# EAGLE design Smart Tools Main Board (EAGLE 9.5.2)

## Sheet 1 of 3: Power Regulation, Battery Charging, Voltage Boost
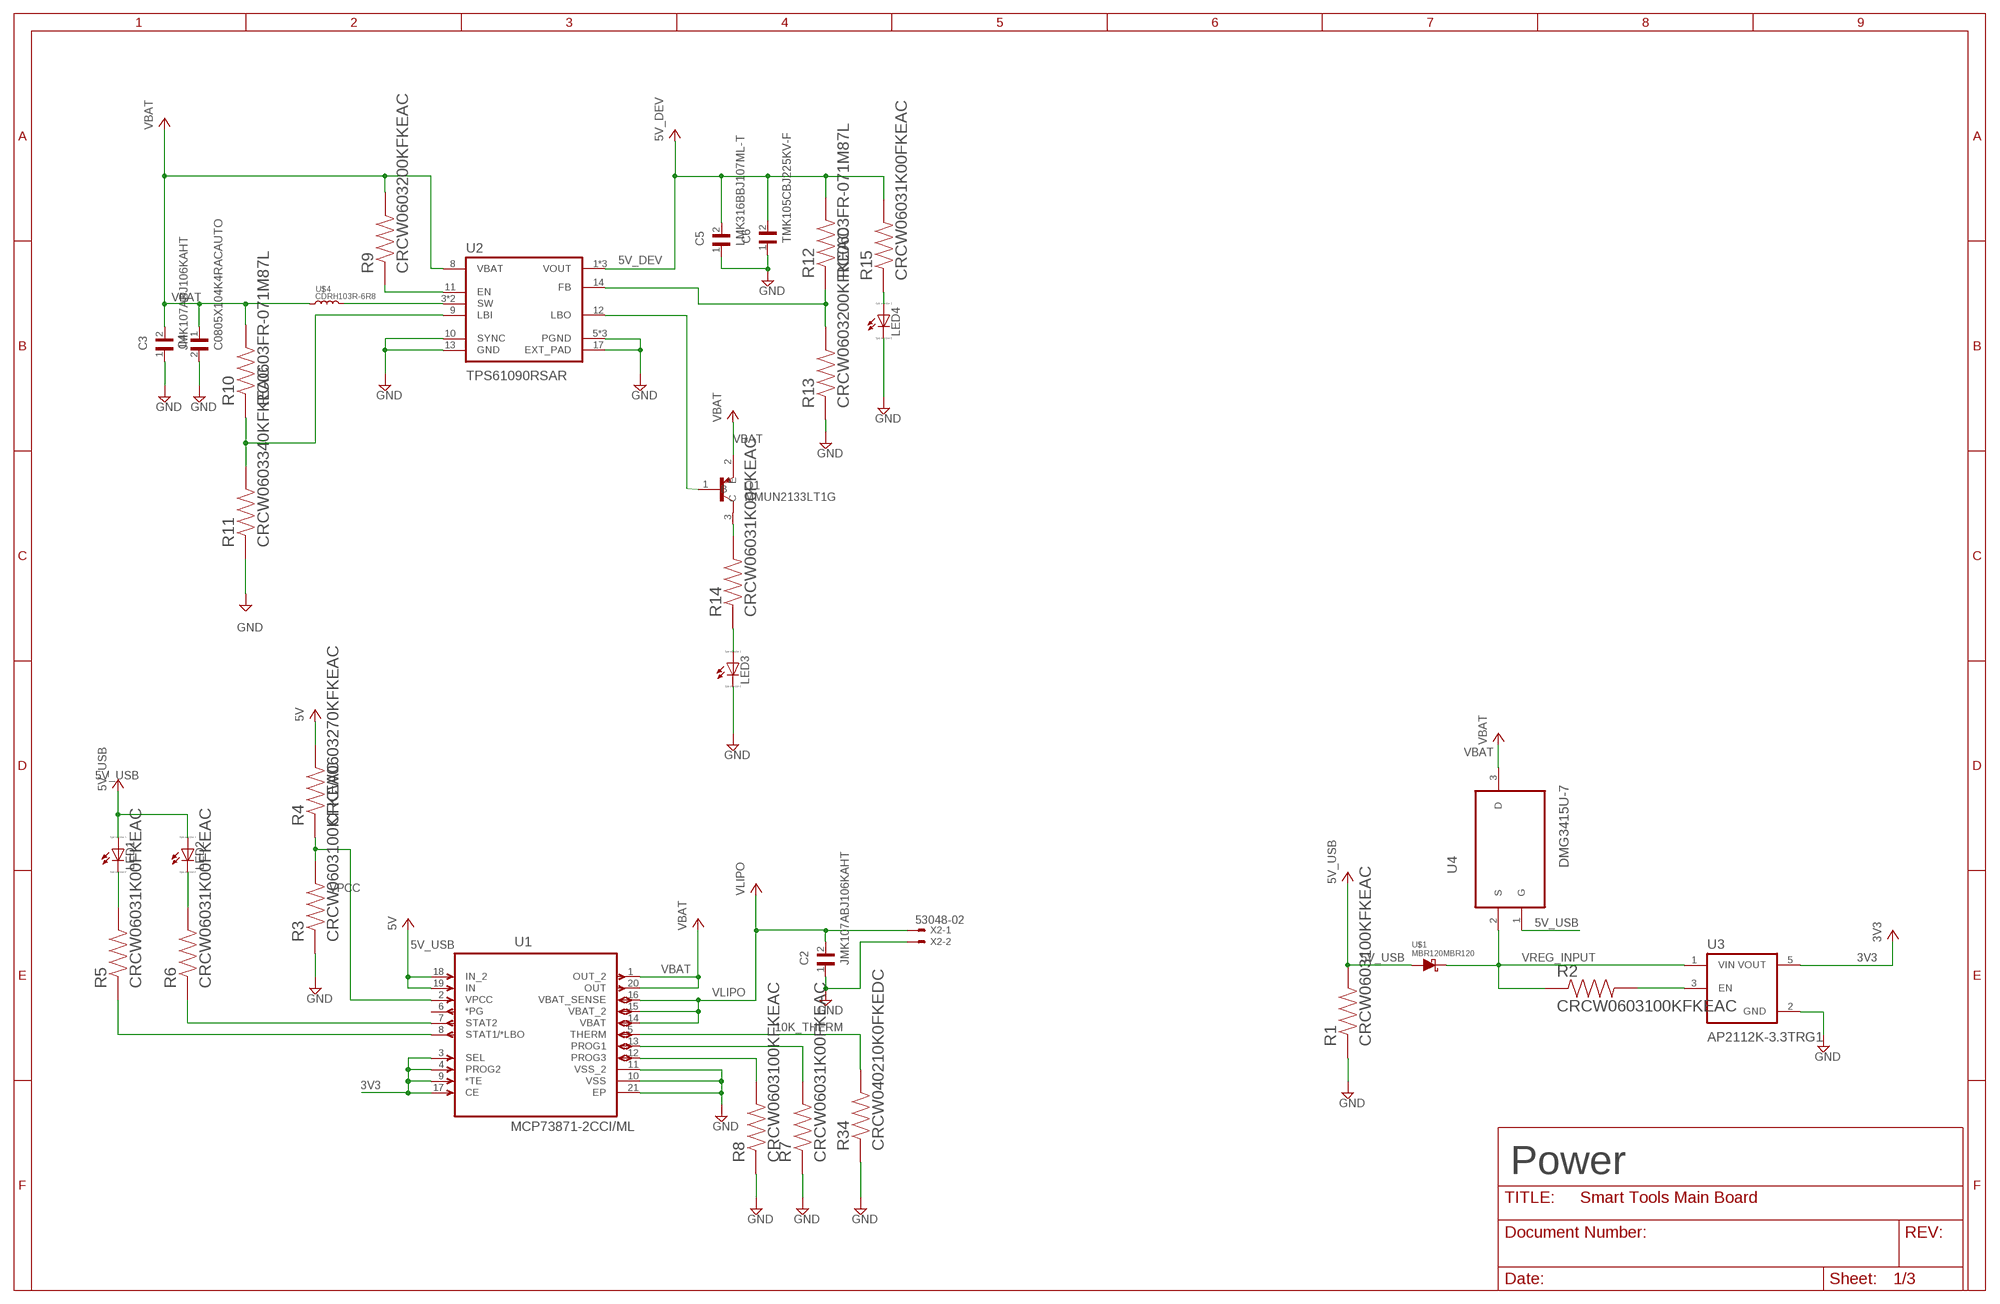
[diagram p0: schematic, sheet 1]

### Parts
C2  JMK107ABJ106KAHT  [CAPC1608X95N]
C3  JMK107ABJ106KAHT  [CAPC1608X95N]
C4  C0805X104K4RACAUTO  [CAPC2012X88N]
C5  LMK316BBJ107ML-T  [CAPC3216X190N]
C6  TMK105CBJ225KV-F  [CAPC1005X70N]
LED1  LED_ESML0603  [LED_SML0603]
LED2  LED_ESML0603  [LED_SML0603]
LED3  LED_ESML0603  [LED_SML0603]
LED4  LED_ESML0603  [LED_SML0603]
Q1  MMUN2133LT1G  [SOT95P240X111-3N]
R1  CRCW0603100KFKEAC  [RESC1608X55N]
R2  CRCW0603100KFKEAC  [RESC1608X55N]
R3  CRCW0603100KFKEAC  [RESC1608X55N]
R4  CRCW0603270KFKEAC  [RESC1608X55N]
R5  CRCW06031K00FKEAC  [RESC1608X55N]
R6  CRCW06031K00FKEAC  [RESC1608X55N]
R7  CRCW06031K00FKEAC  [RESC1608X55N]
R8  CRCW0603100KFKEAC  [RESC1608X55N]
R9  CRCW0603200KFKEAC  [RESC1608X55N]
R10  RC0603FR-071M87L  [RESC1608X55N]
R11  CRCW0603340KFKEAC  [RESC1608X55N]
R12  RC0603FR-071M87L  [RESC1608X55N]
R13  CRCW0603200KFKEAC  [RESC1608X55N]
R14  CRCW06031K00FKEAC  [RESC1608X55N]
R15  CRCW06031K00FKEAC  [RESC1608X55N]
R34  CRCW040210K0FKEDC  [RESC1005X35N]
U1  MCP73871-2CCI/ML  [QFN50P400X400X100-21N]
U2  TPS61090RSAR  [QFN65P400X400X100-17N]
U3  AP2112K-3.3TRG1  [SOT95P285X140-5N]
U4  DMG3415U-7  [SOT95P240X105-3N]
U$1  MBR120MBR120  [SODFL3616X98N]
U$4  CDRH103R-6R8  [CDRH103R-6R8]
X2  53048-02  [53048-02]

### Nets
3V3: U1.3(SEL) U1.4(PROG2) U1.9(*TE) U1.17(CE) U3.5(VOUT) ; also sheet 2
5V_DEV: C5.2 C6.2 R12.2 R15.2 U2.1(VOUT) U2.15(VOUT) U2.16(VOUT) ; also sheet 3
5V_USB: LED1.A LED2.A R1.2 U1.18(IN_2) U1.19(IN) U4.1(G) U$1.1(A) ; supply symbol labelled 5V ; also sheet 2
10K_THERM: R34.2 U1.5(THERM)
EN: R9.1 U2.11(EN)
FB: R12.1 R13.2 U2.14(FB)
GND: C2.1 C3.1 C4.2 C5.1 C6.1 LED3.C LED4.C R1.1 R3.1 R7.1 R8.1 R11.1 R13.1 R34.1 U1.10(VSS) U1.11(VSS_2) U1.21(EP) U2.5(PGND) U2.6(PGND) U2.7(PGND) U2.10(SYNC) U2.13(GND) U2.17(EXT_PAD) U3.2(GND) X2.2 ; also sheet 2,3
LBI: R10.1 R11.2 U2.9(LBI)
N$1: R2.2 U3.3(EN)
N$3: R6.1 U1.7(STAT2)
N$4: R5.1 U1.8(STAT1/*LBO)
N$5: LED1.C R5.2
N$6: LED2.C R6.2
N$8: R7.2 U1.13(PROG1)
N$9: R8.2 U1.12(PROG3)
N$13: Q1.1(B) U2.12(LBO)
N$14: Q1.3(C) R14.2
N$15: LED3.A R14.1
N$17: LED4.A R15.1
SW: U2.3(SW) U2.4(SW) U$4.2
VBAT: C3.2 C4.1 Q1.2(E) R9.2 R10.2 U1.1(OUT_2) U1.20(OUT) U2.8(VBAT) U4.3(D) U$4.1 ; also sheet 2
VLIPO: C2.2 R4.2 U1.14(VBAT) U1.15(VBAT_2) U1.16(VBAT_SENSE) X2.1 ; supply symbol labelled 5V
VPCC: R3.2 R4.1 U1.2(VPCC)
VREG_INPUT: R2.1 U3.1(VIN) U4.2(S) U$1.2(C)
Unconnected: U1.6(*PG)

### Notes on the sheet
- Power

## Sheet 2 of 3: ESP32
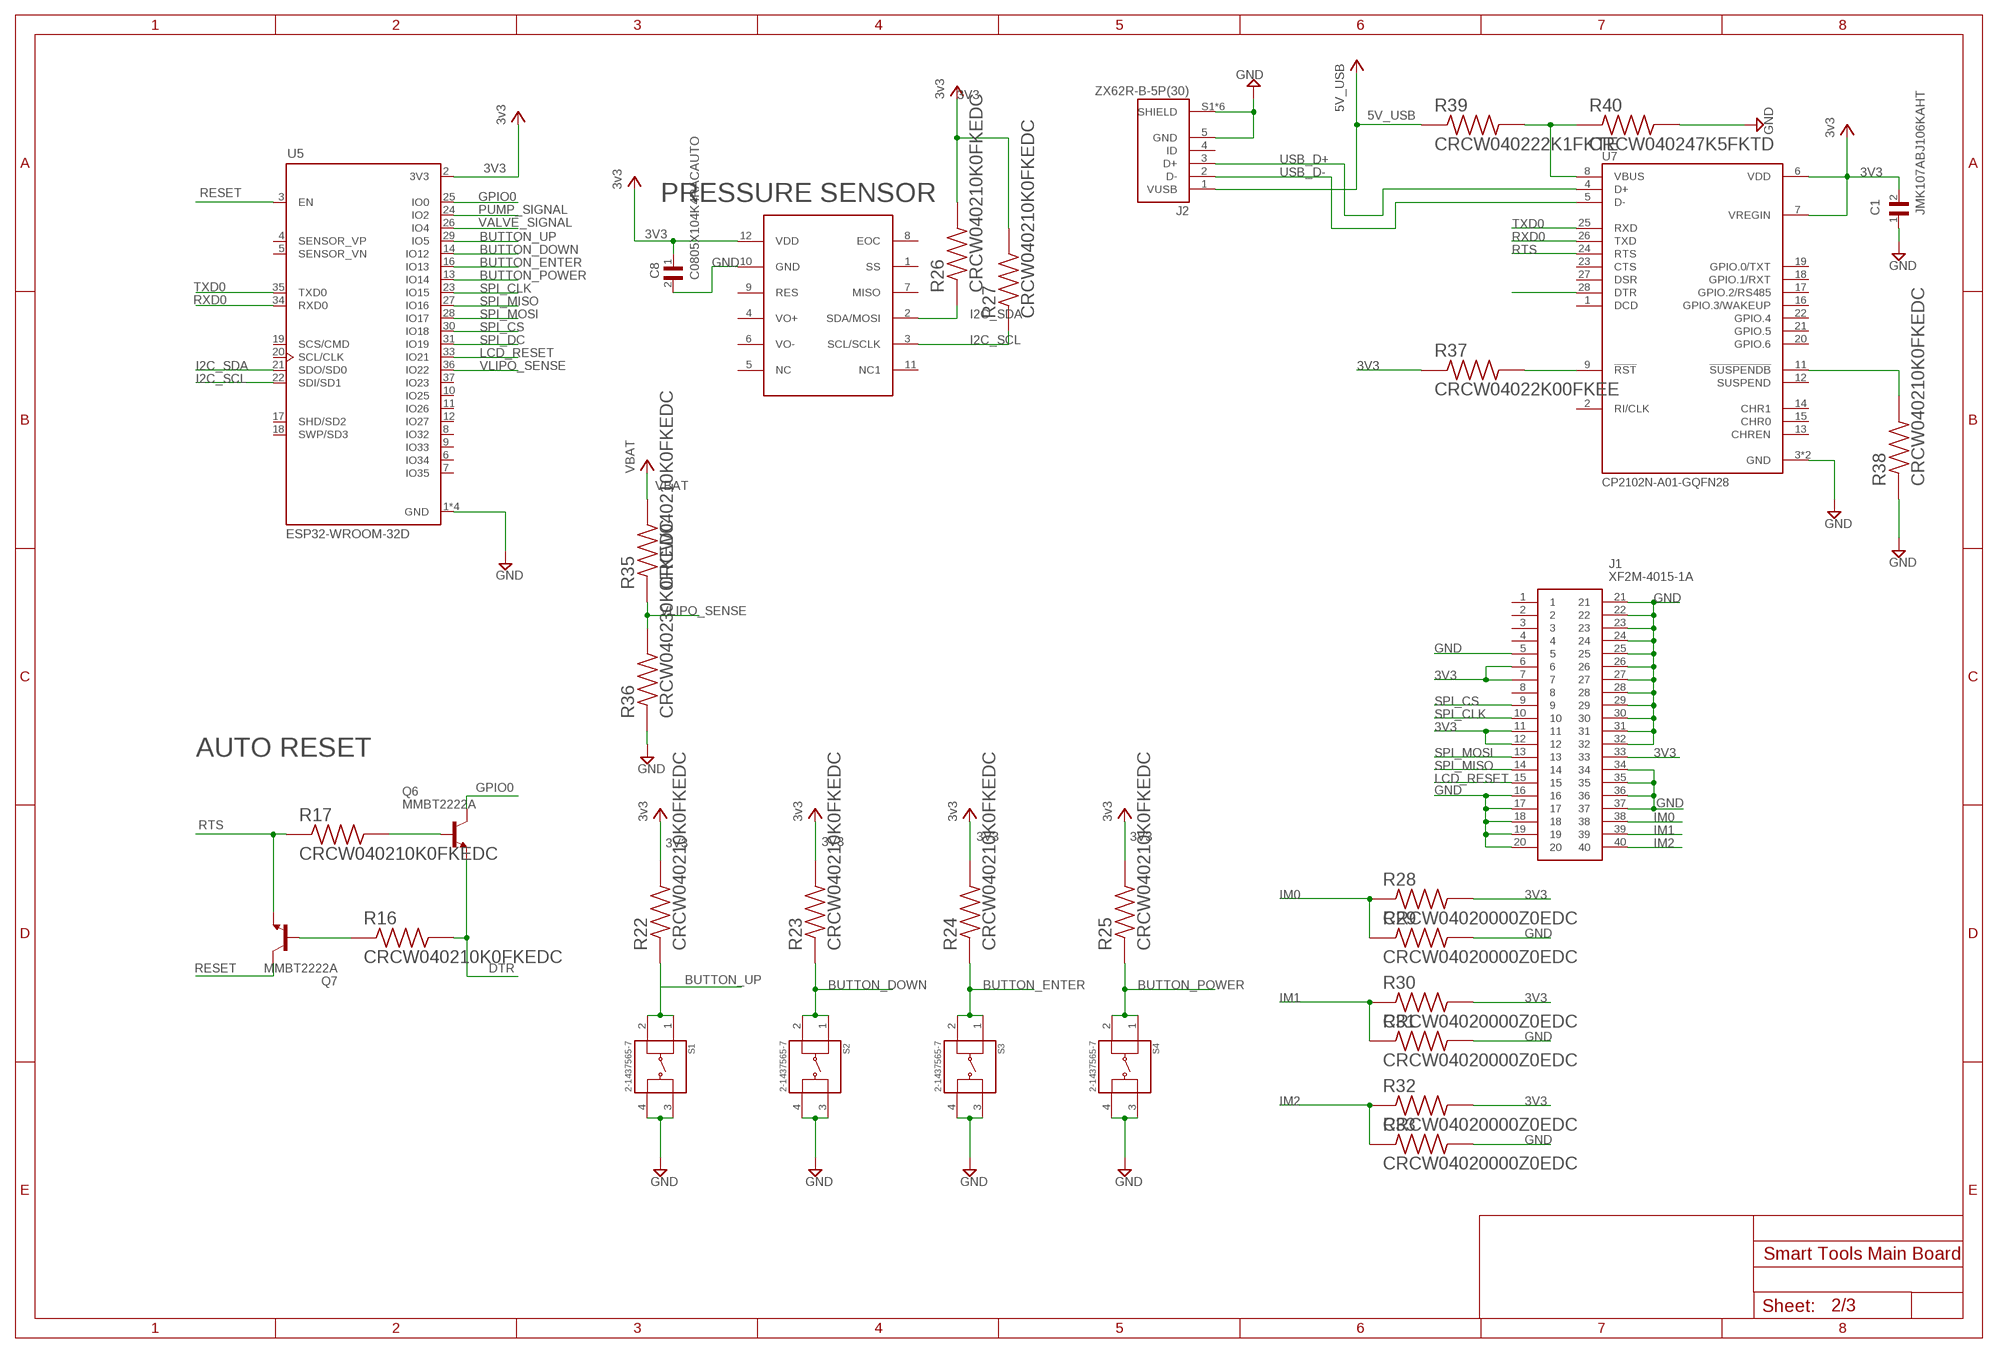
[diagram p1: schematic, sheet 2]

### Parts
C1  JMK107ABJ106KAHT  [CAPC1608X95N]
C8  C0805X104K4RACAUTO  [CAPC2012X88N]
J1  XF2M-4015-1A  [XF2M-XX15-1A]
J2  ZX62R-B-5P(30)  [HRS_ZX62R-B-5P(30)]
Q6  MMBT2222A  [SOT23]
Q7  MMBT2222A  [SOT23]
R16  CRCW040210K0FKEDC  [RESC1005X35N]
R17  CRCW040210K0FKEDC  [RESC1005X35N]
R22  CRCW040210K0FKEDC  [RESC1005X35N]
R23  CRCW040210K0FKEDC  [RESC1005X35N]
R24  CRCW040210K0FKEDC  [RESC1005X35N]
R25  CRCW040210K0FKEDC  [RESC1005X35N]
R26  CRCW040210K0FKEDC  [RESC1005X35N]
R27  CRCW040210K0FKEDC  [RESC1005X35N]
R28  CRCW04020000Z0EDC  [RESC1005X35N]
R29  CRCW04020000Z0EDC  [RESC1005X35N]
R30  CRCW04020000Z0EDC  [RESC1005X35N]
R31  CRCW04020000Z0EDC  [RESC1005X35N]
R32  CRCW04020000Z0EDC  [RESC1005X35N]
R33  CRCW04020000Z0EDC  [RESC1005X35N]
R35  CRCW040210K0FKEDC  [RESC1005X35N]
R36  CRCW040230K0FKEDC  [RESC1005X35N]
R37  CRCW04022K00FKEE  [RESC1005X40N]
R38  CRCW040210K0FKEDC  [RESC1005X35N]
R39  CRCW040222K1FKTE  [RESC1005X40N]
R40  CRCW040247K5FKTD  [RESC1005X40N]
S1  2-1437565-7  [SW_2-1437565-7]
S2  2-1437565-7  [SW_2-1437565-7]
S3  2-1437565-7  [SW_2-1437565-7]
S4  2-1437565-7  [SW_2-1437565-7]
U5  ESP32-WROOM-32D  [MODULE_ESP32-WROOM-32D]
U7  CP2102N-A01-GQFN28  [QFN50P500X500X80-29N]
U$5  MPRLS0015PG0000SAMPRLS0015PG0000SA  [QFN127P500X500X582-12N]

### Nets
3V3: C1.2 C8.1 J1.6 J1.7 J1.11 J1.12 J1.33 R22.2 R23.2 R24.2 R25.2 R26.2 R27.2 R28.2 R30.2 R32.2 R37.1 U5.2(3V3) U7.6(VDD) U7.7(VREGIN) U$5.12(VDD) ; supply symbol labelled 3v3 ; also sheet 1
5V_USB: J2.1(VUSB) R39.1 ; also sheet 1
BUTTON_DOWN: R23.1 S2.1 S2.2 U5.14(IO12)
BUTTON_ENTER: R24.1 S3.1 S3.2 U5.16(IO13)
BUTTON_POWER: R25.1 S4.1 S4.2 U5.13(IO14)
BUTTON_UP: R22.1 S1.1 S1.2 U5.29(IO5)
DTR: Q6.2(E) R16.2 U7.28(DTR)
GND: C1.1 C8.2 J1.5 J1.16 J1.17 J1.18 J1.19 J1.20 J1.21 J1.22 J1.23 J1.24 J1.25 J1.26 J1.27 J1.28 J1.29 J1.30 J1.31 J1.32 J1.34 J1.35 J1.36 J1.37 J2.5(GND) J2.S1(SHIELD) J2.S2(SHIELD) J2.S3(SHIELD) J2.S4(SHIELD) J2.S5(SHIELD) J2.S6(SHIELD) R29.2 R31.2 R33.2 R36.1 R38.1 R40.2 S1.3 S1.4 S2.3 S2.4 S3.3 S3.4 S4.3 S4.4 U5.1(GND) U5.15(GND) U5.38(GND) U5.39(GND) U7.3(GND) U7.29(GND) U$5.10(GND) ; also sheet 1,3
GPIO0: Q6.3(C) U5.25(IO0)
I2C_SCL: R27.1 U5.22(SDI/SD1) U$5.3(SCL/SCLK)
I2C_SDA: R26.1 U5.21(SDO/SD0) U$5.2(SDA/MOSI)
IM0: J1.38 R28.1 R29.1
IM1: J1.39 R30.1 R31.1
IM2: J1.40 R32.1 R33.1
LCD_RESET: J1.15 U5.33(IO21)
N$16: Q7.1(B) R16.1
N$18: Q6.1(B) R17.2
N$20: R37.2 U7.9(!RST)
N$21: R38.2 U7.11(!SUSPENDB)
N$24: R39.2 R40.1 U7.8(VBUS)
PUMP_SIGNAL: U5.24(IO2) ; also sheet 3
RESET: Q7.3(C) U5.3(EN)
RTS: Q7.2(E) R17.1 U7.24(RTS)
RXD0: U5.34(RXD0) U7.26(TXD)
SPI_CLK: J1.10 U5.23(IO15)
SPI_CS: J1.9 U5.30(IO18)
SPI_DC: U5.31(IO19)
SPI_MISO: J1.14 U5.27(IO16)
SPI_MOSI: J1.13 U5.28(IO17)
TXD0: U5.35(TXD0) U7.25(RXD)
USB_D+: J2.3(D+) U7.4(D+)
USB_D-: J2.2(D-) U7.5(D-)
VALVE_SIGNAL: U5.26(IO4) ; also sheet 3
VBAT: R35.2 ; also sheet 1
VLIPO_SENSE: R35.1 R36.2 U5.36(IO22)
Unconnected: J1.1 J1.2 J1.3 J1.4 J1.8 J2.4(ID) U5.4(SENSOR_VP) U5.5(SENSOR_VN) U5.6(IO34) U5.7(IO35) U5.8(IO32) U5.9(IO33) U5.10(IO25) U5.11(IO26) U5.12(IO27) U5.17(SHD/SD2) U5.18(SWP/SD3) U5.19(SCS/CMD) U5.20(SCL/CLK) U5.37(IO23) U7.1(DCD) U7.2(RI/CLK) U7.12(SUSPEND) U7.13(CHREN) U7.14(CHR1) U7.15(CHR0) U7.16(GPIO.3/WAKEUP) U7.17(GPIO.2/RS485) U7.18(GPIO.1/RXT) U7.19(GPIO.0/TXT) U7.20(GPIO.6) U7.21(GPIO.5) U7.22(GPIO.4) U7.23(CTS) U7.27(DSR) U$5.1(SS) U$5.4(VO+) U$5.5(NC) U$5.6(VO-) U$5.7(MISO) U$5.8(EOC) U$5.9(RES) U$5.11(NC1)

### Notes on the sheet
- PRESSURE SENSOR
- AUTO RESET

## Sheet 3 of 3: Pump/Valve Driver
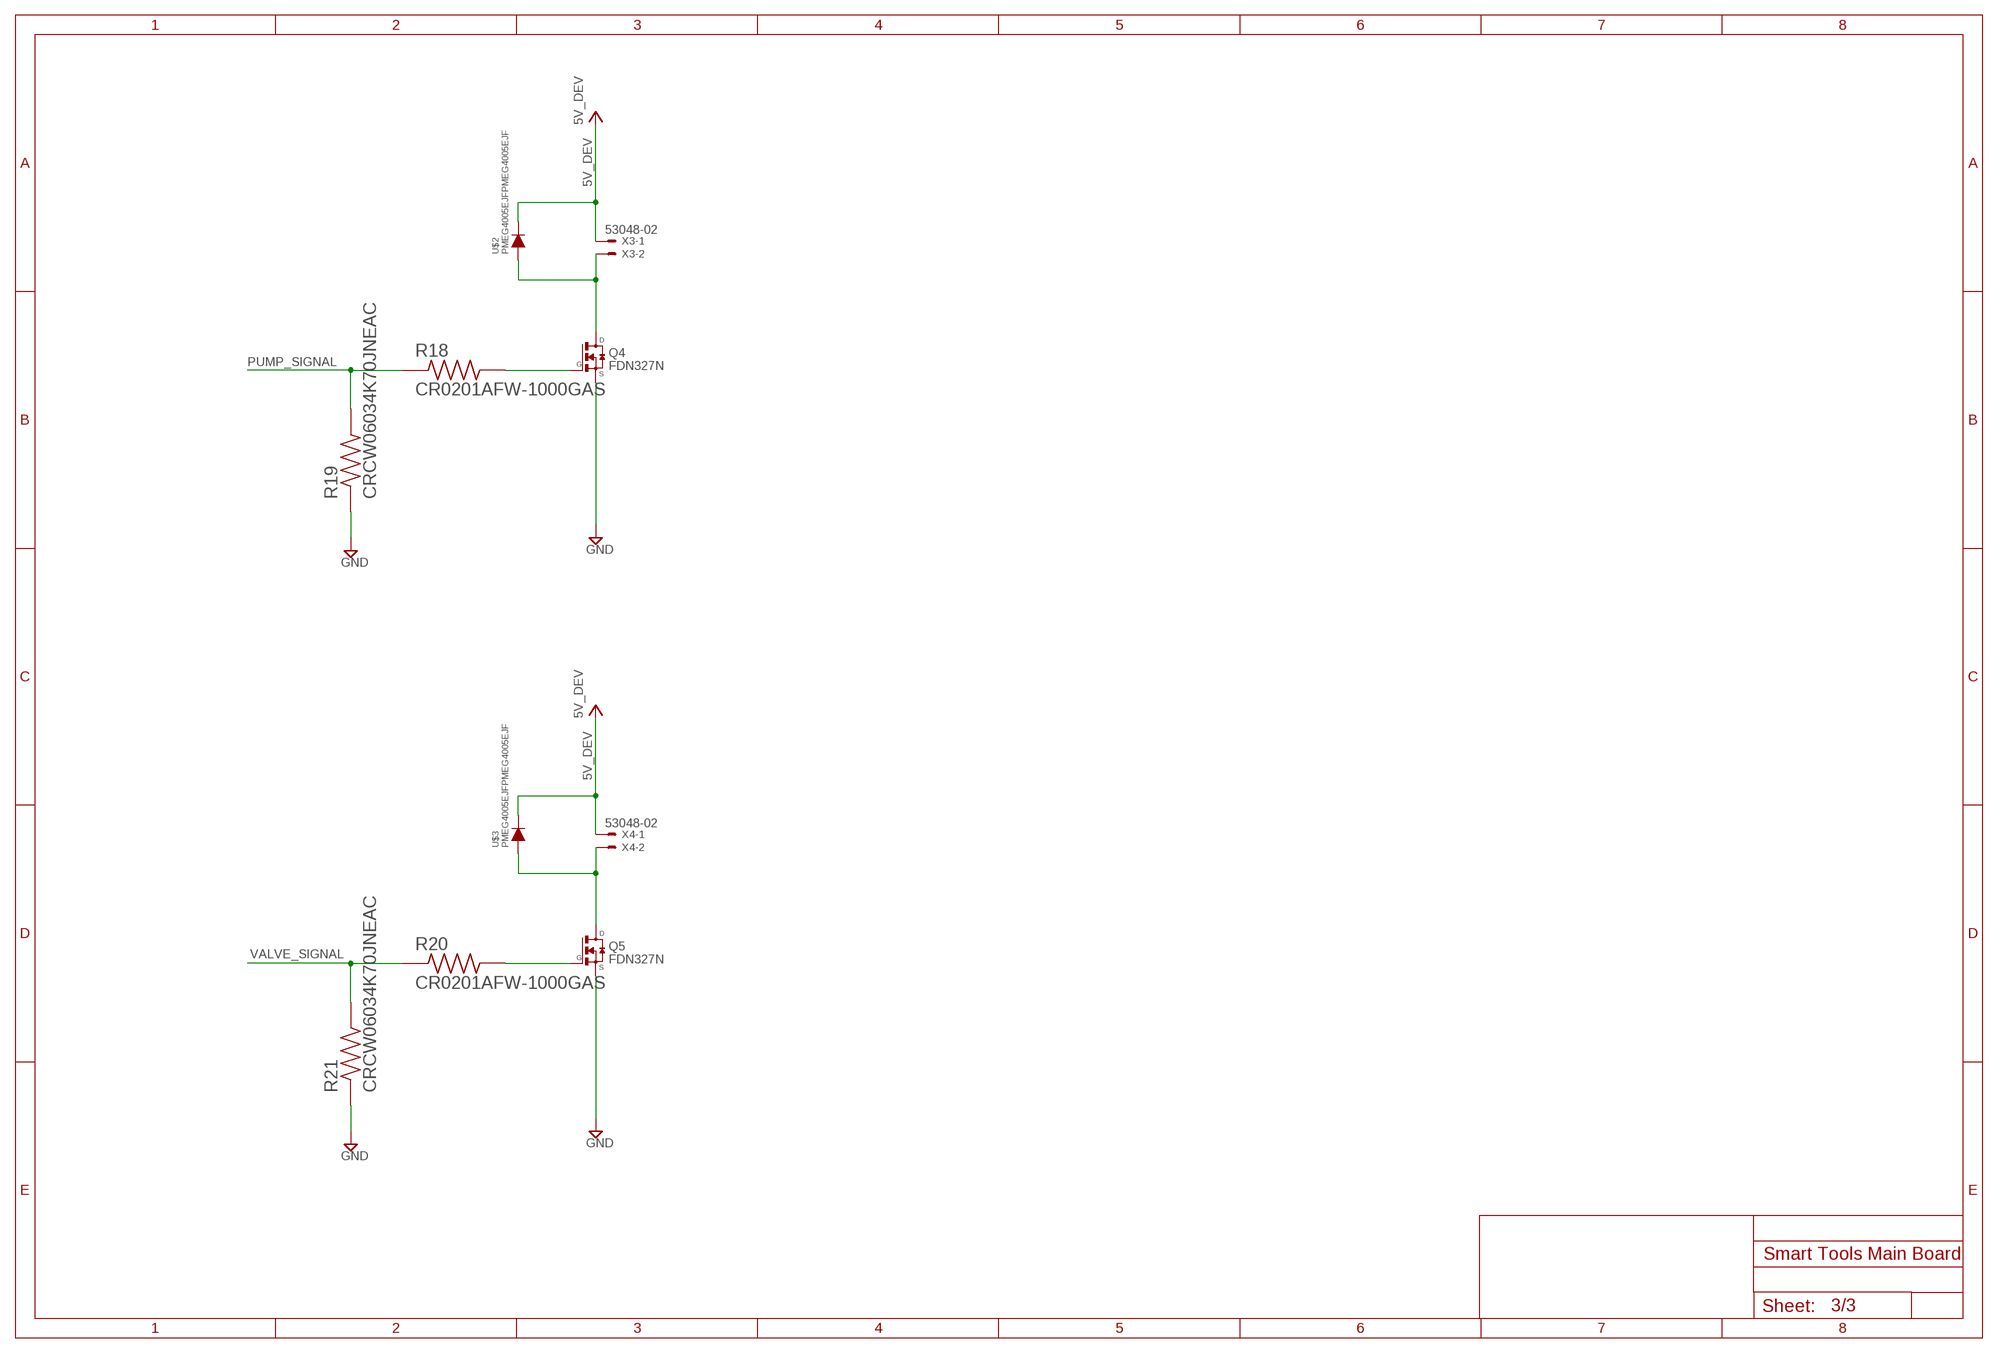
[diagram p2: schematic, sheet 3]

### Parts
Q4  FDN327N  [SSOT-3]
Q5  FDN327N  [SSOT-3]
R18  CR0201AFW-1000GAS  [RESC0603X26N]
R19  CRCW06034K70JNEAC  [RESC1608X55N]
R20  CR0201AFW-1000GAS  [RESC0603X26N]
R21  CRCW06034K70JNEAC  [RESC1608X55N]
U$2  PMEG4005EJFPMEG4005EJF  [SOD2512X80N]
U$3  PMEG4005EJFPMEG4005EJF  [SOD2512X80N]
X3  53048-02  [53048-02]
X4  53048-02  [53048-02]

### Nets
5V_DEV: U$2.2(C) U$3.2(C) X3.1 X4.1 ; also sheet 1
GND: Q4.2(S) Q5.2(S) R19.1 R21.1 ; also sheet 1,2
N$22: Q4.1(G) R18.2
N$23: Q4.3(D) U$2.1(A) X3.2
N$25: Q5.1(G) R20.2
N$26: Q5.3(D) U$3.1(A) X4.2
PUMP_SIGNAL: R18.1 R19.2 ; also sheet 2
VALVE_SIGNAL: R20.1 R21.2 ; also sheet 2

## Library data of the parts
C1-C3 = JMK107ABJ106KAHT:JMK107ABJ106KAHT; AVAILABILITY: Unavailable; DESCRIPTION: 0; MF: Taiyo Yuden; MP: JMK107ABJ106KAHT; PACKAGE: 1608 Taiyo Yuden; PRICE: None
C4 C8 = C0805X104K4RACAUTO:C0805X104K4RACAUTO; AVAILABILITY: Unavailable; DESCRIPTION: CAP CER 0.1UF 16V X7R 0805; MF: KEMET; MP: C0805X104K4RACAUTO; PACKAGE: 0805 KEMET; PRICE: None
C5 = LMK316BBJ107ML-T:LMK316BBJ107ML-T; AVAILABILITY: Unavailable; DESCRIPTION: CAP, MLCC, 1206/3216, 10V, X5R,; MF: Taiyo Yuden; MP: LMK316BBJ107ML-T; PACKAGE: 3216 Taiyo Yuden; PRICE: None
C6 = TMK105CBJ225KV-F:TMK105CBJ225KV-F; AVAILABILITY: Unavailable; DESCRIPTION: CAP CER 2.2UF 25V X5R 0402; MF: Taiyo Yuden; MP: TMK105CBJ225KV-F; PACKAGE: 1005 Taiyo Yuden; PRICE: None
J1 = XF2M-4015-1A:XF2M-4015-1A: Omron XF2M Series 0.5mm Pitch 40 Way 1 Row Right Angle SMT Female FPC Connector Locking Mechanism Source: Datasheet <https://componentsearchengine.com/Datasheets/1/XF2M-4015-1A.pdf>; DESCRIPTION: Omron XF2M Series 0.5mm Pitch 40 Way 1 Row Right Angle SMT Female FPC Connector Locking Mechanism; HEIGHT: mm; MANUFACTURER_NAME: Omron Electronics; MANUFACTURER_PART_NUMBER: XF2M-4015-1A; MOUSER_PART_NUMBER: 653-XF2M-4015-1A; MOUSER_PRICE-STOCK: https://www.mouser.com/Search/Refine.aspx?Keyword=653-XF2M-4015-1A
J2 = ZX62R-B-5P_30_:ZX62R-B-5P(30): ZX Series 5 Pin Single Port USB 2.0 Micro B Top Mount Receptacle Male; AVAILABILITY: Unavailable; DESCRIPTION: USB - micro B USB 2.0 Receptacle Connector 5 Position Surface Mount, Right Angle; MF: Hirose; MP: ZX62R-B-5P_30_; PACKAGE: None; PRICE: None
LED1-LED4 = eagle-ltspice:LED_E: LED Source: http://www.osram.convergy.de Source: www.luxeon.com Source: www.kingbright.com; SPICEMODEL: NONE; SPICEPREFIX: D; SPICETYPE: diode
Q1 = MMUN2133LT1G:MMUN2133LT1G: Bias Resistor Transistors PNP Silicon SM Transistors with Monolithic Bias Resistor Network; AVAILABILITY: Unavailable; DESCRIPTION: Bias Resistor Transistors PNP Silicon SM Transistors with Monolithic Bias Resistor Network; MF: ON Semiconductor; MP: MMUN2133LT1G; PACKAGE: SOT-23-3 ON Semiconductor; PRICE: None
Q4 Q5 = FDN327N:FDN327N: N-Channel MOSFET 1.8 Vgs Specified PowerTrench; AVAILABILITY: Unavailable; DESCRIPTION: N-Channel 20V 70 mOhm 1.8 V Specified PowerTrench Mosfet - SSOT-3; MF: ON Semiconductor; MP: FDN327N; PACKAGE: SC-59 ON Semiconductor; PRICE: None
Q6 Q7 = MMBT2222A-2:MMBT2222A: 2N2222 General Purpose NPN Transistor; AVAILABILITY: Unavailable; DESCRIPTION: Bipolar _BJT_ Transistor NPN 40V 600mA 300MHz 310mW Surface Mount SOT-23-3; MF: STMicroelectronics; MP: MMBT2222A; PACKAGE: TO-236-3 Taitron; PRICE: None
R1-R3 R8 = CRCW0603100KFKEAC:CRCW0603100KFKEAC: Res Thick Film 0603 100K Ohm 1% 1/10W Â±100ppm/Â°C Molded SMD Paper T/R; AVAILABILITY: Unavailable; DESCRIPTION: Viscrcw0603100kfkeac Chip Res 0603 100k; MF: Vishay Dale; MP: CRCW0603100KFKEAC; PACKAGE: 1608 Rohm Semiconductor; PRICE: None
R4 = CRCW0603270KFKEAC:CRCW0603270KFKEAC: RES 270K OHM 1% 1/10W 0603; AVAILABILITY: Unavailable; DESCRIPTION: Res Thick Film 0603 270K Ohm 1% 1/10W ±100ppm/°C Molded SMD Paper T/R; MF: Vishay; MP: CRCW0603270KFKEAC; PACKAGE: 1608 Rohm Semiconductor; PRICE: None
R5-R7 R14 R15 = CRCW06031K00FKEAC:CRCW06031K00FKEAC; AVAILABILITY: Unavailable; DESCRIPTION: D11/CRCW0603-C 100 1K0 1% ET1; MF: Vishay Dale; MP: CRCW06031K00FKEAC; PACKAGE: 1608 Rohm Semiconductor; PRICE: None
R9 R13 = CRCW0603200KFKEAC:CRCW0603200KFKEAC; DESCRIPTION: Standard Thick Film Chip Resistors; DIGI-KEY_PART_NUMBER: 541-4027-1-ND; DIGI-KEY_PURCHASE_URL: https://www.digikey.com/product-detail/en/vishay-dale/CRCW0603200KFKEAC/541-4027-1-ND/7928710?utm_source=snapeda&utm_medium=aggregator&utm_campaign=symbol; MF: Vishay; MP: CRCW0603200KFKEAC; PACKAGE: 1608 Rohm Semiconductor
R10 R12 = RC0603FR-071M87L:RC0603FR-071M87L: RES SMD 1.87M OHM 1% 1/10W 0603; AVAILABILITY: Unavailable; DESCRIPTION: Res Thick Film 0603 1.87M Ohm 1% 0.1W_1/10W_ ±100ppm/C Molded SMD Paper T/R; MF: Yageo; MP: RC0603FR-071M87L; PACKAGE: 1608 Yageo; PRICE: None
R11 = CRCW0603340KFKEAC:CRCW0603340KFKEAC; AVAILABILITY: Unavailable; DESCRIPTION: D11/CRCW0603-C 100 340K 1% ET1; MF: Vishay; MP: CRCW0603340KFKEAC; PACKAGE: 1608 Rohm Semiconductor; PRICE: None
R16 R17 R22-R27 R34 R35 R38 = CRCW040210K0FKEDC:CRCW040210K0FKEDC: RES SMD 10K OHM 1% 1/16W 0402; AVAILABILITY: Unavailable; DESCRIPTION: Res Thick Film 0402 10K Ohm 1% 1/16W ±100ppm/°C Molded SMD Paper T/R; MF: Vishay Dale; MP: CRCW040210K0FKEDC; PACKAGE: 1005 Yageo; PRICE: None
R18 R20 = CR0201AFW-1000GAS:CR0201AFW-1000GAS; AVAILABILITY: Unavailable; DESCRIPTION: ResA-AS 0201 100R 1% 50mW TC200; MF: Bourns; MP: CR0201AFW-1000GAS; PACKAGE: 0603 Rohm Semiconductor; PRICE: None
R19 R21 = CRCW06034K70JNEAC:CRCW06034K70JNEAC; AVAILABILITY: Unavailable; DESCRIPTION: D11/CRCW0603-C 200 4K7 5% ET1; MF: Vishay; MP: CRCW06034K70JNEAC; PACKAGE: 1608 Rohm Semiconductor; PRICE: None
R28-R33 = CRCW04020000Z0EDC:CRCW04020000Z0EDC; AVAILABILITY: Unavailable; DESCRIPTION: 0 Ohms Jumper 0.063W, 1/16W Chip Resistor 0402 _1005 Metric_ Thick Film; MF: Vishay Dale; MP: CRCW04020000Z0EDC; PACKAGE: 1005 Yageo; PRICE: None
R36 = CRCW040230K0FKEDC:CRCW040230K0FKEDC; AVAILABILITY: Unavailable; DESCRIPTION: Res Thick Film 0402 30K Ohm 1% 0.063W_1/16W_ ±100ppm/°C Pad SMD T/R; MF: Vishay; MP: CRCW040230K0FKEDC; PACKAGE: 1005 Yageo; PRICE: None
R37 = CRCW04022K00FKEE:CRCW04022K00FKEE; AVAILABILITY: Unavailable; DESCRIPTION: Res Thick Film 0402 2K Ohm 1% 0.063W_1/16W_ ±100ppm/C SMD Automotive T/R; MF: Vishay; MP: CRCW04022K00FKEE; PACKAGE: 1005 Panasonic Electronic Components; PRICE: None
R39 = CRCW040222K1FKTE:CRCW040222K1FKTE: Res Thick Film 0402 22.1K Ohm 1% 0.063W(1/16W) ±100ppm/C SMD Automotive T/R; AVAILABILITY: Unavailable; DESCRIPTION: Res Thick Film 0402 22.1K Ohm 1% 0.063W_1/16W_ ±100ppm/C SMD Automotive T/R; MF: Vishay; MP: CRCW040222K1FKTE; PACKAGE: 1005 Panasonic Electronic Components; PRICE: None
R40 = CRCW040247K5FKTD:CRCW040247K5FKTD: RES -FILM RESISTORS-THICK FILM CHIP; AVAILABILITY: Unavailable; DESCRIPTION: Res Thick Film 0402 47.5K Ohm 1% 1/16W ±100ppm/°C Molded SMD SMD Paper T/R; MF: Vishay Dale; MP: CRCW040247K5FKTD; PACKAGE: 1005 Panasonic Electronic Components; PRICE: None
S1-S4 = 2-1437565-7:2-1437565-7: FSM2JSMA=SMT,TACTILE,PB SWITCH; AVAILABILITY: Unavailable; COMMENT: 2-1437565-7; CONFIGURATION_POLE-THROW: Single Pole - Single Throw; CONTACT_CURRENT_RATING: 50 mA; DESCRIPTION: Alcoswitch; Switch; Tactile; Mico-Miniature; Pushbutton; SPST; Surface Mount; MF: TE Connectivity; MP: 2-1437565-7; PACKAGE: None; PRICE: None; TE_PURCHASE_URL: https://www.te.com/usa-en/product-2-1437565-7.html?te_bu=Cor&te_type=disp&te_campaign=seda_glo_cor-seda-global-disp-prtnr-fy19-seda-model-bom-cta_sma-317_1&elqCampaignId=32493
U1 = MCP73871-2CCI_ML:MCP73871-2CCI/ML: IC, BATTERY CHARGER, 1A; AVAILABILITY: Unavailable; DESCRIPTION: Fully Integrated Single Cell Lithium Ion/Lithium Polymer Charge Management Contr; MF: Microchip; MP: MCP73871-2CCI/ML; PACKAGE: QFN-20 Microchip; PRICE: None
U2 = TPS61090RSAR:TPS61090RSAR: None; AVAILABILITY: Unavailable; DESCRIPTION: 2A Switch, 96% Efficient Boost Converter 16-QFN -40 to 85; MF: Texas Instruments; MP: TPS61090RSAR; PACKAGE: VQFN-16 Texas Instruments; PRICE: None
U3 = AP2112K-3.3TRG1:AP2112K-3.3TRG1: AP2112 Series 0.6 A 3.3 V Fixed Output SMT LDO Linear Regulator - SOT23-5; AVAILABILITY: Unavailable; DESCRIPTION: AP2112 Series 0.6 A 3.3 V Fixed Output SMT LDO Linear Regulator - SOT23-5; MF: Diodes Inc.; MP: AP2112K-3.3TRG1; PACKAGE: SOT-753 Diodes Inc.; PRICE: None
U4 = DMG3415U-7:DMG3415U-7: P-CHANNEL ENHANCEMENT MODE MOSFET; AVAILABILITY: Unavailable; DESCRIPTION: DMG3415U Series 20 V 39 mOhm P-Channel Enhancement Mode Mosfet - SOT-23-3; MF: Diodes Inc.; MP: DMG3415U-7; PACKAGE: SOT-23-3 Diodes Inc.; PRICE: None
U5 = ESP32-WROOM-32D:ESP32-WROOM-32D: IC: SoC; GPIO, I2C, I2S, IR, SD, SDIO, SPI, UART; 2.7÷3.6VDC; 20dBm; AVAILABILITY: Unavailable; DESCRIPTION: IC: SoC; GPIO, I2C, I2S, IR, SD, SDIO, SPI, UART; 2.7÷3.6VDC; 20dBm; MF: Espressif Systems; MP: ESP32-WROOM-32D; PACKAGE: Module Espressif Systems; PRICE: None
U7 = CP2102N-A01-GQFN28:CP2102N-A01-GQFN28: Ic Bridge Usb To Uart 28qfn; AVAILABILITY: Unavailable; DESCRIPTION: USB Bridge, USB to UART USB 2.0 UART Interface 28-QFN _5x5_; MF: Silicon Labs; MP: CP2102N-A01-GQFN28; PACKAGE: QFN-28 Silicon Labs; PRICE: None
U$1 = MBR120:MBR120: https://www.snapeda.com/parts/MBR120VLSFT3G/ON%20Semiconductor/datasheet/
U$2 U$3 = PMEG4005EJF:PMEG4005EJF
U$4 = CDRH103R-6R8:CDRH103R-6R8
U$5 = MPRLS Pressure Sensor:MPRLS0015PG0000SA
X2-X4 = con-molex:53?-02: CONNECTOR wire to board 1.25 mm (.049 inch) pitch header; MF: MOLEX; MPN: 53048-0210; OC_FARNELL: 1012259; OC_NEWARK: 57H4718

## Board
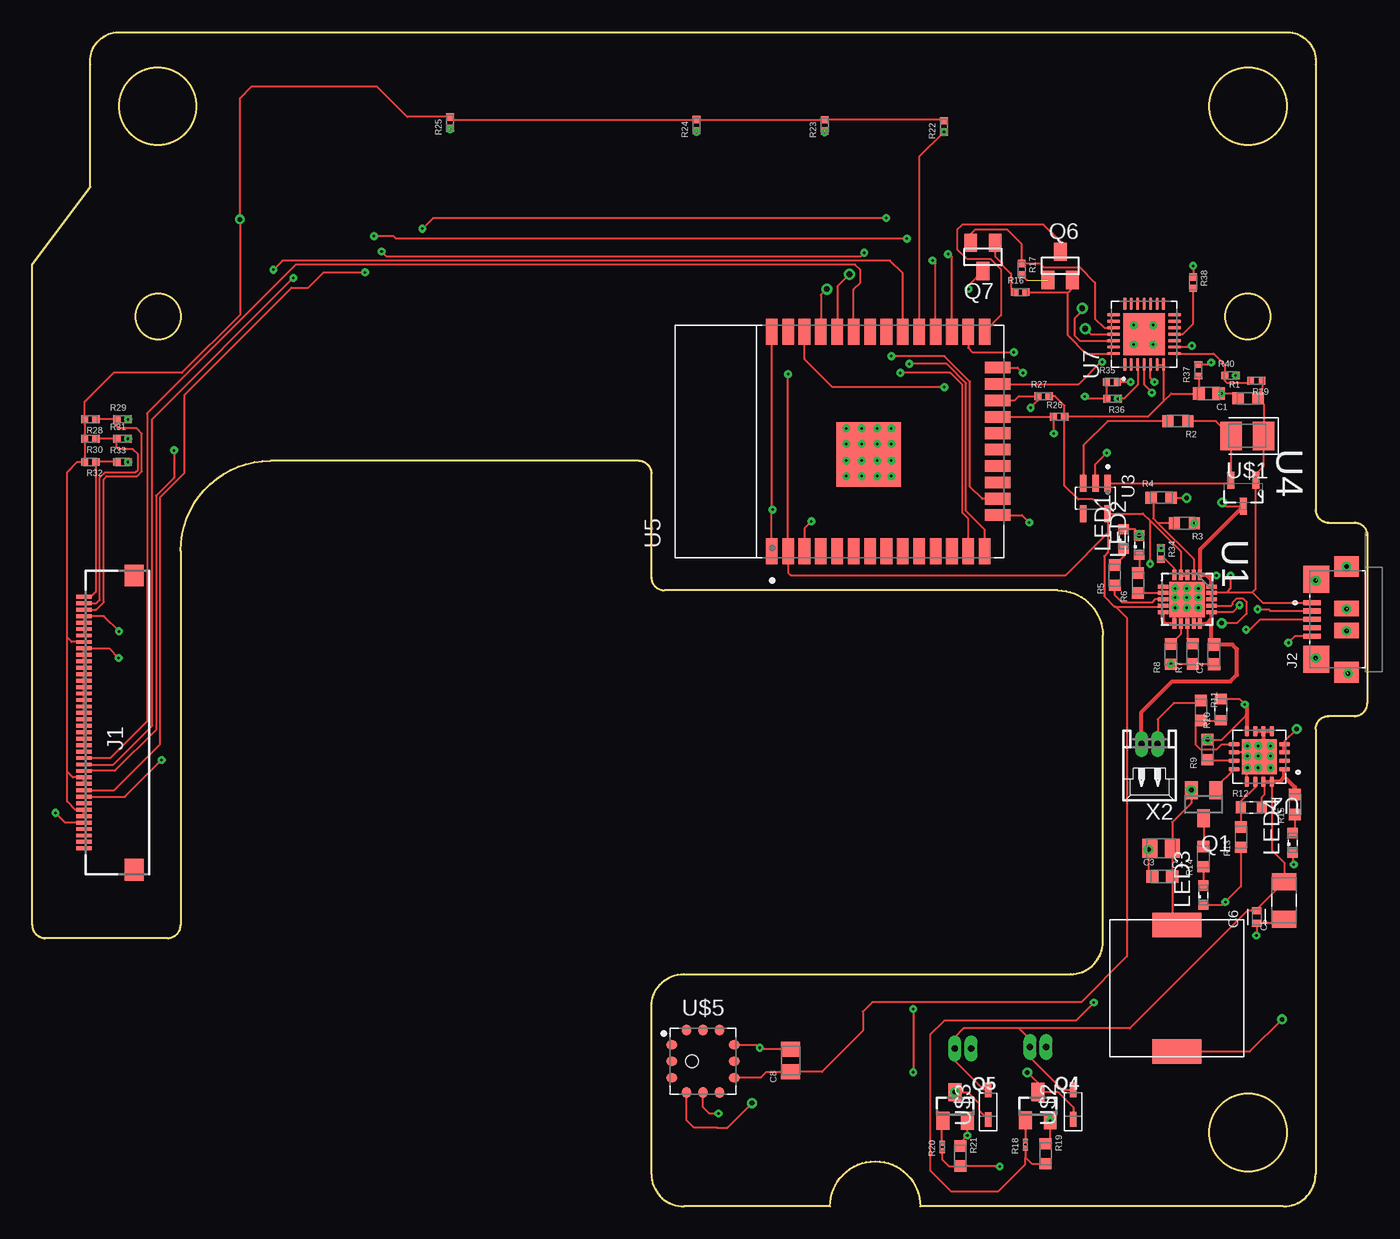
[diagram p3: board, top side]
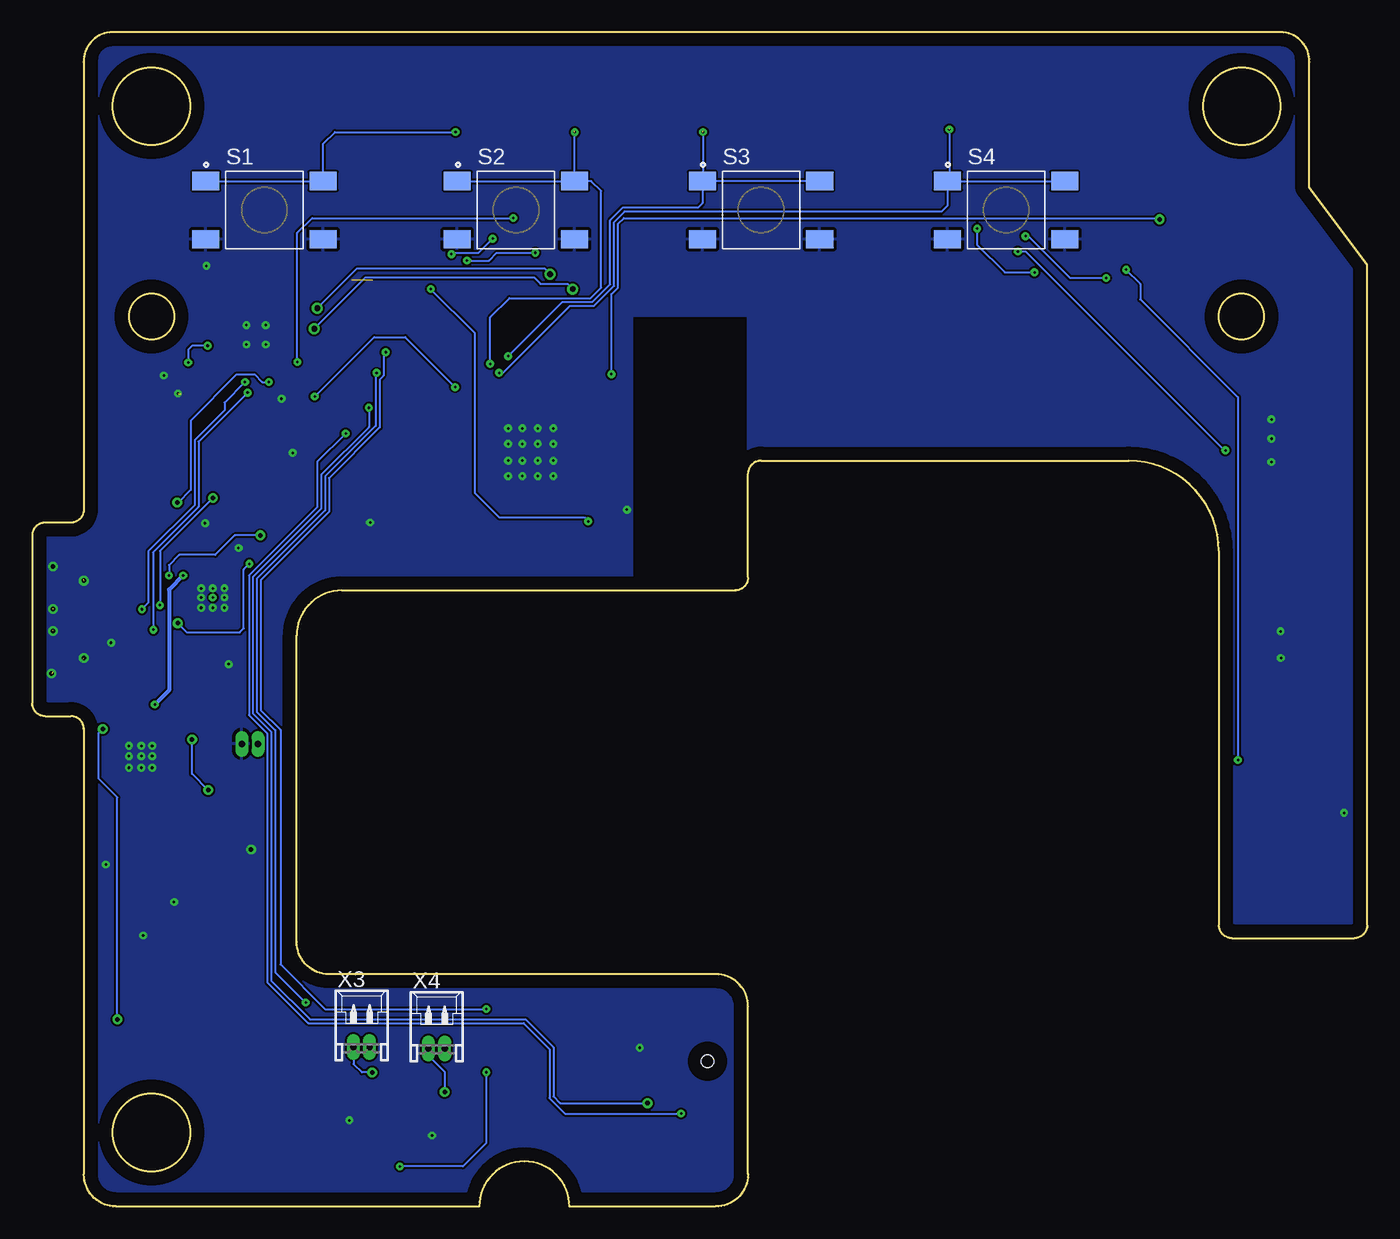
[diagram p4: board, bottom side, seen from below]

Size 103.5 x 91 mm. Coordinates in mm from the lower left corner, seen from the top.
Outline: 0,21.8 0,73 4.5,79 4.5,88.5 arc-90 6.5,91 97.5,91 arc-90 99.5,88.5 99.5,54 arc90 100.5,53 102.5,53 arc-90 103.5,52 103.5,39 arc-90 102.5,38 100.5,38 arc90 99.5,37 99.5,2.5 arc-90 97,0 68.85,0 arc180 61.85,0 50.53,0 arc-90 48,2.5 48,15.5 arc-90 50.5,18 80.5,18 arc90 83,20.5 83,44.25 arc90 79.5,47.75 49,47.75 arc-90 48,48.75 48,56.8 arc90 47,57.8 18.5,57.8 arc90 11.5,50.8 11.5,21.8 arc-90 10.5,20.8 1,20.8 arc-90 0,21.8
Outline: circle at 94.27,85.27 radius 3
Outline: circle at 9.73,85.27 radius 3
Outline: circle at 9.75,68.97 radius 1.75
Outline: circle at 94.25,68.97 radius 1.75
Outline: circle at 94.27,5.73 radius 3
Copper layers (1*16): Top 0.035mm / dielectric 1.5mm / Bottom 0.035mm
Design rules "default": minimum track width 6mil, minimum drill 0.35mm, track to track 6mil, track to pad 6mil, pad to pad 6mil, via to via 6mil, smd to smd 6mil, copper to edge 40mil, drill to drill 6mil, minimum pad ring 10mil, minimum via ring 8mil, stop-mask expansion 4mil, vias tented up to drill 0mil, thermal gap 10mil

### Footprints (pad centres in the part's own frame; a part is rotated, then mirrored left to right if it is on the bottom)
CAPC1608X95N = smd 0.95 x 0.98: 1 -0.763,0; 2 0.763,0
CAPC2012X88N = smd 1.16 x 1.47: 1 -0.875,0; 2 0.875,0
CAPC3216X190N = smd 1.32 x 1.91: 1 -1.446,0; 2 1.446,0
CAPC1005X70N = smd 0.56 x 0.73: 1 -0.485,0; 2 0.485,0
XF2M-XX15-1A = smd 0.3 x 1.2: 1 -9.75,0; 2 -9.25,0; 3 -8.75,0; 4 -8.25,0; 5 -7.75,0; 6 -7.25,0; 7 -6.75,0; 8 -6.25,0; 9 -5.75,0; 10 -5.25,0; 11 -4.75,0; 12 -4.25,0; 13 -3.75,0; 14 -3.25,0; 15 -2.75,0; 16 -2.25,0; 17 -1.75,0; 18 -1.25,0; 19 -0.75,0; 20 -0.25,0; 21 0.25,0; 22 0.75,0; 23 1.25,0; 24 1.75,0; 25 2.25,0; 26 2.75,0; 27 3.25,0; 28 3.75,0; 29 4.25,0; 30 4.75,0; 31 5.25,0; 32 5.75,0; 33 6.25,0; 34 6.75,0; 35 7.25,0; 36 7.75,0; 37 8.25,0; 38 8.75,0; 39 9.25,0; 40 9.75,0 | smd 1.7 x 1.5: 41 -11.4,-3.9; 42 11.4,-3.9
HRS_ZX62R-B-5P(30) = smd 0.4 x 1.35: 1 1.3,2.675; 2 0.65,2.675; 3 0,2.675; 4 -0.65,2.675; 5 -1.3,2.675 | smd 2.1 x 2: S1 -3.1,2.35; S2 3.1,2.35 | smd 1.6 x 1.9: S3 4.1,0; S6 -4.1,0 | smd 1.2 x 1.9: S4 0.85,0; S5 -0.85,0
LED_SML0603 = smd 0.8 x 0.8: A 0.75,0; C -0.75,0
SOT95P240X111-3N = smd 1 x 1.4: 1 -0.95,-1.1; 2 0.95,-1.1; 3 0,1.1
SSOT-3 = smd 1 x 1.4: 1 -0.95,-1.1; 2 0.95,-1.1; 3 0,1.1
SOT23 = smd 1 x 1.4: 1 -0.95,-1.1; 2 0.95,-1.1; 3 0,1.1
RESC1608X55N = smd 0.87 x 0.93: 1 -0.78,0; 2 0.78,0
RESC1608X55N' = smd 0.79 x 0.93: 1 -0.82,0; 2 0.82,0
RESC1005X35N = smd 0.56 x 0.6: 1 -0.435,0; 2 0.435,0
RESC0603X26N = smd 0.38 x 0.4: 1 -0.281,0; 2 0.281,0
RESC1005X40N = smd 0.51 x 0.6: 1 -0.445,0; 2 0.445,0
SW_2-1437565-7 = smd 2.1 x 1.4: 1 -4.55,2.25; 2 4.55,2.25; 3 -4.55,-2.25; 4 4.55,-2.25
QFN50P400X400X100-21N = smd 0.813 x 0.305: 1 -1.88,0.991; 2 -1.88,0.508; 3 -1.88,0; 4 -1.88,-0.508; 5 -1.88,-0.991; 11 1.88,-0.991; 12 1.88,-0.508; 13 1.88,0; 14 1.88,0.508; 15 1.88,0.991 | smd 0.305 x 0.813: 6 -0.991,-1.88; 7 -0.508,-1.88; 8 0,-1.88; 9 0.508,-1.88; 10 0.991,-1.88; 16 0.991,1.88; 17 0.508,1.88; 18 0,1.88; 19 -0.508,1.88; 20 -0.991,1.88 | smd 2.743 x 2.743: 21 0,0
QFN65P400X400X100-17N = smd 0.81 x 0.34: 1 -1.955,0.975; 2 -1.955,0.325; 3 -1.955,-0.325; 4 -1.955,-0.975; 9 1.955,-0.975; 10 1.955,-0.325; 11 1.955,0.325; 12 1.955,0.975 | smd 0.34 x 0.81: 5 -0.975,-1.955; 6 -0.325,-1.955; 7 0.325,-1.955; 8 0.975,-1.955; 13 0.975,1.955; 14 0.325,1.955; 15 -0.325,1.955; 16 -0.975,1.955 | smd 2.7 x 2.7: 17 0,0
SOT95P285X140-5N = smd 1.35 x 0.6: 1 -1.185,0.95; 2 -1.185,0; 3 -1.185,-0.95; 4 1.185,-0.95; 5 1.185,0.95
SOT95P240X105-3N = smd 1.321 x 0.559: 1 -1.016,0.965; 2 -1.016,-0.965; 3 1.016,0
MODULE_ESP32-WROOM-32D = smd 2 x 0.9: 1 -8.5,5.26; 2 -8.5,3.99; 3 -8.5,2.72; 4 -8.5,1.45; 5 -8.5,0.18; 6 -8.5,-1.09; 7 -8.5,-2.36; 8 -8.5,-3.63; 9 -8.5,-4.9; 10 -8.5,-6.17; 11 -8.5,-7.44; 12 -8.5,-8.71; 13 -8.5,-9.98; 14 -8.5,-11.25; 25 8.5,-11.25; 26 8.5,-9.98; 27 8.5,-8.71; 28 8.5,-7.44; 29 8.5,-6.17; 30 8.5,-4.9; 31 8.5,-3.63; 32 8.5,-2.36; 33 8.5,-1.09; 34 8.5,0.18; 35 8.5,1.45; 36 8.5,2.72; 37 8.5,3.99; 38 8.5,5.26 | smd 0.9 x 2: 15 -5.715,-12.25; 16 -4.445,-12.25; 17 -3.175,-12.25; 18 -1.905,-12.25; 19 -0.635,-12.25; 20 0.635,-12.25; 21 1.905,-12.25; 22 3.175,-12.25; 23 4.445,-12.25; 24 5.715,-12.25 | smd 5 x 5: 39 -1,-2.24
QFN50P500X500X80-29N = smd 1.01 x 0.27: 1 -2.36,1.5; 2 -2.36,1; 3 -2.36,0.5; 4 -2.36,0; 5 -2.36,-0.5; 15 2.36,-1.5; 16 2.36,-1; 17 2.36,-0.5; 18 2.36,0; 19 2.36,0.5; 20 2.36,1; 21 2.36,1.5 | smd 1.01 x 0.254: 6 -2.36,-1; 7 -2.36,-1.5 | smd 0.27 x 1.01: 8 -1.5,-2.36; 9 -1,-2.36; 10 -0.5,-2.36; 11 0,-2.36; 12 0.5,-2.36; 13 1,-2.36; 14 1.5,-2.36; 22 1.5,2.36; 23 1,2.36; 24 0.5,2.36; 25 0,2.36; 26 -0.5,2.36; 27 -1,2.36; 28 -1.5,2.36 | smd 3.25 x 3.25: 29 0,0
SODFL3616X98N = smd 1.665 x 2.208: 1 -1.275,0; 2 1.275,0
SOD2512X80N = smd 1.136 x 0.497: 1 -1.139,0; 2 1.139,0
CDRH103R-6R8 = smd 3.81 x 1.93: 1 5.2,10.2; 2 5.2,0.4
QFN127P500X500X582-12N = smd 0.743 x 0.86: 1 1.27,-2.435; 2 0,-2.435; 3 -1.27,-2.435; 7 -1.27,2.435; 8 0,2.435; 9 1.27,2.435 | smd 0.86 x 0.743: 4 -2.435,-1.27; 5 -2.435,0; 6 -2.435,1.27; 10 2.435,1.27; 11 2.435,0; 12 2.435,-1.27 | hole 1: -0.86,0
53048-02 = drill 0.5 pad 0.698 long: 1 0.625,-1.25; 2 -0.625,-1.25

### Placement (x,y rotation side)
C1  91.2,63 180 top
C2  91.61,42.78 90 top
C3  87.61,25.57 0 top
C4  87.51,27.76 180 top
C5  97.06,23.72 90 top
C6  94.92,22.44 90 top
C8  58.8,11.3 90 top
J1  4,37.5 90 top
J2  101.9,45.5 90 top
LED1  84.62,51.74 90 top
LED2  85.82,51.26 90 top
LED3  90.79,24.13 90 top
LED4  97.71,28.19 90 top
Q1  90.81,31.17 180 top
Q4  77.96,7.77 0 top
Q5  71.54,7.75 0 top
Q6  79.7,72.9 0 top
Q7  73.7,73.6 180 top
R1  94.26,62.62 0 top
R2  88.82,60.87 180 top
R3  89.32,52.95 180 top
R4  87.52,54.94 0 top
R5  83.92,48.93 90 top
R6  85.72,48.32 90 top
R7  89.97,42.82 90 top
R8  88.27,42.81 90 top
R9  91.11,35.4 90 top
R10  RC0603FR-071M87L  [RESC1608X55N']  92.15,38.51 90 top
R11  90.61,38.44 270 top
R12  RC0603FR-071M87L  [RESC1608X55N']  94.51,30.93 0 top
R13  93.71,28.62 90 top
R14  90.79,27.11 90 top
R15  97.89,31.15 90 top
R16  76.6,70.86 0 top
R17  76.7,72.65 270 top
R18  76.99,4.79 90 top
R19  78.56,4.08 270 top
R20  70.54,4.61 90 top
R21  71.95,3.91 270 top
R22  70.68,83.7 90 top
R23  61.44,83.79 90 top
R24  51.5,83.8 90 top
R25  32.4,84 90 top
R26  79.6,61.2 0 top
R27  78.4,62.8 0 top
R28  4.5,61 180 top
R29  7,61 0 top
R30  4.5,59.5 180 top
R31  7,59.5 0 top
R32  4.5,57.7 180 top
R33  7,57.7 0 top
R34  87.5,50.6 270 top
R35  83.7,63.9 0 top
R36  83.74,62.6 180 top
R37  90.4,64.8 90 top
R38  90,71.6 270 top
R39  94.9,64 180 top
R40  92.9,64.4 0 top
S1  85.5,77.22 0 bottom
S2  66,77.22 0 bottom
S3  47,77.22 0 bottom
S4  28,77.22 0 bottom
U1  89.54,47.05 270 top
U2  95.13,34.86 180 top
U3  82.43,54.87 270 top
U4  93.89,55.28 270 top
U5  62.59,59.29 90 top
U7  86.2,67.6 90 top
U$1  94.2,59.72 180 top
U$2  80.71,7.9 90 top
U$3  74.11,7.89 90 top
U$4  83.54,11.61 0 top
U$5  52,11.25 0 top
X2  86.63,34.6 180 top
X3  77.97,13.59 0 bottom
X4  72.15,13.49 0 bottom

### Tracks (layer width: path | path; a pad name or v marks a point on that pad's centre or on a via)
3V3  (via drill 0.2, 0.35)
  Top 0.152: 83.4,53.69 U3.5 82.27,54.8 81.1,54.8 80.03,55.87 R26.2 | 83.4,53.69 86.11,53.69 86.67,53.13 | U1.4 89.03,50.77 86.67,53.13 | 87.7,62.4 86.5,61.2 R26.2 | R26.2 80.03,62.06 79.3,62.8 R27.2 | 83.4,53.69 83.4,52.2 | 83.4,52.2 80.12,48.92 58.8,48.92 58.6,49.12 U5.2 v58.6,64.5 | 83.4,52.2 83.4,50.7 83.1,50.4 83.1,47.3 83.91,46.49 84,46.49 | U1.9 87.61,46.49 84,46.49 | 84,46.49 84.87,45.62 84.87,19.37 81.33,15.83 65.13,15.83 64.4,15.1 64.4,13.6 61.23,10.43 C8.1 56.92,10.43 56.5,10 54.45,10 U$5.12 | R24.2 32.6,84.23 R25.2 29.07,84.44 26.7,86.8 17,86.8 16.1,85.9 v16.1,76.5 16.1,69.1 11.6,64.6 6.3,64.6 4.07,62.37 R28.2 R30.2 R32.2 3.5,57.7 2.7,56.9 2.7,44.1 | R24.2 | R22.2 70.59,84.22 R23.2 R24.2 | J1.6 J1.7 3.35,30.75 2.7,31.4 2.7,33.7 | J1.11 J1.12 3.15,33.25 2.7,33.7 | 2.7,33.7 2.7,44.1 | U1.17 92.94,46.54 93.07,46.67 93.07,46.82 93.38,47.13 93.87,47.13 94.13,46.87 94.13,45.93 93.4,45.2 v92.22,45.2 | v86.67,49.8 86.67,53.13 | R37.1 90.44,64.32 C1.2 88.3,63 87.7,62.4 | U7.6 U7.7 87.7,62.4 | J1.33 3.05,43.75 2.7,44.1
  Top 0.305: U1.3 U1.4
  Bottom 0.152: v58.6,64.5 58.6,70.71 58.09,71.22 58.09,76.15 57.64,76.6 16.2,76.6 v16.1,76.5 | v92.22,45.2 91.52,44.5 87.4,44.5 87.1,44.8 87.1,49.37 v86.67,49.8
5V_DEV
  Top 0.152: R12.2 95.33,31.73 95.5,31.9 95.5,32.86 U2.15 | 96.12,32.92 U2.16 96.11,27.59 97.06,26.64 C5.2 94.92,23.03 C6.2 94.89,22.9 94.2,22.9 85.1,13.8 76.5,13.8 | 97.08,33.28 97.08,33.3 | U$3.2 74.08,9.06 73.74,9.06 71.53,11.28 X4.1 71.53,13.12 72.2,13.8 76.5,13.8 | 76.5,13.8 77.34,12.96 X3.1 77.36,12.32 77.36,11.55 79.88,9.04 U$2.2
  Top 0.305: U2.15 U2.16 | 97.08,33.28 96.72,32.92 96.12,32.92 | U2.1 97.08,33.3 97.89,32.49 R15.2
5V_USB  (via drill 0.2, 0.35)
  Top 0.152: U1.19 91.42,47.6 92.6,47.6 | 92.6,47.6 94.6,47.6 | U4.1 94.75,56.2 | 94.6,47.6 94.86,47.85 U4.1 | LED1.A 85.5,52.5 85.82,52.18 LED2.A | v92.9,48.9 92.9,47.9 92.6,47.6 | U4.1 94.86,56.76 95.47,57.38 U$1.1 95.47,62.19 R1.2 | 95.24,62.82 R1.2 | J2.1 95.4,46.8 94.6,47.6 | R1.2 95.04,63.04 95.4,63.4 95.4,63.95 R39.1
  Top 0.305: U1.19 U1.18
  Bottom 0.152: LED2.A 87.79,52.01 89.3,50.5 92.1,50.5 92.9,49.7 v92.9,48.9
  other vias: 85.82,52.01
10K_THERM
  Top 0.152: U1.5 88.55,49.45 87.83,50.16 R34.2
BUTTON_DOWN  (via drill 0.2)  (1 unrouted)
  Top 0.152: v68,65.3 70.9,65.3 72.4,63.8 72.4,53.9 73.84,52.46 U5.14
  Bottom 0.152: v68,65.3 68,68.9 66.5,70.4 60.2,70.4 59.4,71.2 59.4,78.7 60.17,79.47 S2.2 | S2.1 S2.2 | S2.2 v61.45,83.25 v61.44,83.25
BUTTON_ENTER  (via drill 0.2)  (1 unrouted)
  Top 0.152: U5.16 73.66,54.84 72.7,55.8 72.7,63.93 70.72,65.91 67.75,65.91 67.74,65.9 v66.6,65.9
  Bottom 0.152: v66.6,65.9 62.41,70.09 60.07,70.09 58.7,71.47 58.7,76.43 57.73,77.4 51.9,77.4 51.55,77.75 S3.1 | S3.2 S3.1 | v51.5,83.27 51.5,79.52 S3.1
BUTTON_POWER  (via drill 0.2)  (1 unrouted)
  Top 0.152: U5.13 72.57,53.3 72.09,53.77 72.09,63.67 71.17,64.6 v67.3,64.6
  Bottom 0.152: v67.3,64.6 67,64.6 61.81,69.79 59.95,69.79 58.4,71.34 58.4,76.28 57.58,77.09 33.01,77.09 32.55,77.55 S4.1 | S4.1 S4.2 | v32.4,83.47 32.4,79.48 S4.1 | 32.6,79.42 S4.1
BUTTON_UP  (via drill 0.2)
  Top 0.152: R22.1 68.76,81.34 U5.29
  Bottom 0.152: S1.1 S1.2 80.95,82.35 80.03,83.27 R22.1 70.8,83.15
  other vias: 70.68,83.27
DTR
  Top 0.152: U7.28 81.7,66.1 80.29,67.51 80.29,70.79 80.36,70.86 | Q6.2 80.65,71.15 80.36,70.86 | R16.2 80.36,70.86
EN
  Top 0.152: U2.11 91.19,34.53 R9.1
FB
  Top 0.152: U2.14 94.81,32.51 93.69,31.39 R12.1 93.71,30.91 R13.2
GND  (via drill 0.2, 0.35)  (6 unrouted)
  Top 0.152: J1.34 J1.35 J1.36 J1.37 5.55,45.75 v6.73,44.57 | J1.16 J1.17 J1.18 J1.19 J1.20 J1.21 J1.22 J1.23 J1.24 J1.25 J1.26 J1.27 J1.28 J1.29 J1.30 J1.31 J1.32 5.95,43.25 v6.7,42.5 | U$5.10 56.18,12.52 v56.4,12.3 56.52,12.18 C8.2 | R21.1 71.95,4.95 v72.5,5.5 v72.49,5.51 Q5.2 | Q4.2 78.91,5.21 R19.1 | C3.1 86.53,25.88 v86.53,27.66 C4.2 | LED3.C 92.28,23.38 v92.5,23.6 93.71,24.81 R13.1 | C5.1 96.74,21.95 C6.1 94.92,21.12 94.9,21.1 v94.9,21 | LED4.C 97.71,26.59 v97.8,26.5 | U2.10 94.81,35.19 U2.17 | 95.45,35.84 95.5,35.8 95.5,35.23 95.23,34.97 | 95.23,34.97 U2.17 | U2.13 94.16,33.95 95.17,34.97 95.23,34.97 | U2.17 95.05,34.94 v95.05,35.7 | R11.1 90.39,39 88.5,39 87.25,37.76 X2.2 | C2.1 89.99,42.02 R7.1 R8.1 | U1.11 88.55,45.87 89.54,46.86 U1.21 89.54,46.44 v89.5,46.4 | R1.1 93.1,63 v92.2,63 | U3.2 82.43,57.53 v83.3,58.4 | U5.15 76.72,53.58 v77.3,53 | U5.1 57.33,53.93 v57.4,54 57.33,54.07 U5.38 | U5.39 64.34,57.8 v64.3,57.8 | v1.8,30.5 2.55,29.75 J1.5 | U2.17 95.13,34.13 95,34 | J2.5 97.9,44.2 v97.39,43.69 | v93.3,64.4 R40.2 | v90,72.9 R38.1 | R36.1 84.61,62.6 85.7,63.69 U7.3 | v86.9,68.3 86.8,68.3 86.2,67.7 U7.29
  Top 0.305: U1.11 87.83,45.17 87.66,45.34 U1.10 | U2.5 U2.6 | U2.6 U2.7 | U2.6 95.45,35.84
  other vias: 7.43,57.7 7.43,59.5 7.43,61 78.91,6.67 94.2,35.7 96,35.7 88.27,42.03 88.6,47.9 88.6,47.2 88.6,46.4 89.5,47.9 90.4,47.9 90.4,47.2 90.4,46.4 87.5,51.03 90.1,52.95 85.4,68.3 85.4,66.8 86.9,66.8 63.1,60.3 64.3,60.3 65.5,60.3 66.6,60.3 63.1,59.1 64.3,59.1 65.5,59.1 66.6,59.1 63.1,57.8 65.5,57.8 66.6,57.8 63.1,56.6 64.3,56.6 65.5,56.6 66.6,56.6 84.17,62.6 101.9,49.6 94.2,34.9 95.05,34.9 96,34.9 94.2,34 95.05,34 96,34 99.5,48.5 101.9,46.3 101.9,44.6 99.5,42.5 102,41.3
  pour Bottom: 6,93 -5,82 -5,77 -5,18 -4,17 14,17 16,19 17,20 17,54 44,54 47,57 48,58 48,69 57,69 57,47 38,28 38,23 38,-4 44,-10 99,-10 112,3 112,87 110,89 106,93
GPIO0
  Top 0.152: U5.25 75.1,69.05 75.1,72.62 74.3,73.43 72.47,73.43 71.7,74.2 71.7,75.7 72.1,76.1 78.4,76.1 79.7,74.8 Q6.3
I2C_SCL  (via drill 0.2, 0.35)
  Top 0.152: U5.22 76.17,62.47 76.5,62.8 R27.1 77.97,62.47 v77.4,61.9 | U$5.3 50.73,6.67 51.3,6.1 53,6.1 53.1,6.1 53.9,6.1 v55.8,8
  Bottom 0.152: v77.4,61.9 77.4,60.4 81.09,56.7 81.09,54.07 86.39,48.77 86.39,38.21 84.97,36.78 84.97,17.5 81.97,14.51 65.27,14.51 63.09,12.33 63.09,8.53 62.57,8 v55.8,8
I2C_SDA  (via drill 0.2)
  Top 0.152: U5.21 R26.1 79.17,59.94 v79.2,59.9 | v53.2,7.2 52.5,7.2 52,7.7 U$5.2
  Bottom 0.152: v79.2,59.9 81.4,57.7 81.4,54.2 86.7,48.9 86.7,38.09 85.27,36.66 85.27,17.37 82.1,14.2 65.4,14.2 63.4,12.2 63.4,8.4 62.2,7.2 v53.2,7.2
IM0
  Top 0.152: J1.38 4.95,46.25 5.54,46.84 5.54,56.37 5.77,56.59 8.13,56.59 8.51,56.97 8.51,59.9 8.1,60.3 6.7,60.3 6.57,60.44 R29.1 R28.1
IM1
  Top 0.152: J1.39 4.97,46.75 5.24,47.02 5.24,56.5 5.64,56.9 8,56.9 8.2,57.1 8.2,58.3 7.8,58.7 6.7,58.7 6.57,58.84 R31.1 R30.1
IM2
  Top 0.152: J1.40 4.55,47.25 4.93,47.63 R32.1 R33.1
LBI
  Top 0.152: R10.1 92.12,37.66 R11.2 90.2,37.25 90.2,35.8 90.6,35.4 91.8,35.4 92.2,35.8 93.14,35.8 U2.9
LCD_RESET
  Top 0.152: U5.33 63.68,71.08 64.2,71.6 64.2,72.6 63.8,73 20.43,73 8.9,61.47 8.9,37.6 6.05,34.75 J1.15
N$1
  Top 0.152: R2.2 83.37,60.87 81.48,58.98 U3.3
N$3
  Top 0.152: U1.7 87.64,47.54 R6.1
N$4
  Top 0.152: U1.8 87.05,47.05 86.8,46.8 84.5,46.8 83.92,47.38 R5.1
N$5
  Top 0.152: R5.2 84.62,50.41 LED1.C
N$6
  Top 0.152: LED2.C 85.82,49.2 R6.2
N$8
  Top 0.152: U1.13 89.54,44.03 R7.2
N$9
  Top 0.152: U1.12 89.03,44.35 R8.2
N$12  (via drill 0.2)
  other vias: 89.5,47.2
N$13
  Top 0.152: U2.12 91.76,32.47 Q1.1
N$14
  Top 0.152: Q1.3 90.81,27.91 R14.2
N$15
  Top 0.152: R14.1 LED3.A
N$16
  Top 0.152: R16.1 76.17,70.94 75.89,71.21 75.89,72.3 75.19,73 75.19,73.11 74.65,73.65 Q7.1
N$17
  Top 0.152: R15.1 97.89,29.12 LED4.A
N$18  (1 unrouted)
  Top 0.152: 77.11,71.8 R17.2
N$20  (via drill 0.2)
  Top 0.152: v91.4,65.4 91.25,65.25 R37.2 | v89.9,66.71 89.79,66.6 U7.9
  Bottom 0.152: v89.9,66.71 91.1,66.71 91.4,66.41 v91.4,65.4
N$21
  Top 0.152: U7.11 89.2,67.6 90,68.4 R38.2
N$22
  Top 0.152: Q4.1 77.01,5.09 R18.2
N$23  (via drill 0.35)
  Top 0.152: v77.14,10.38 77.96,9.57 Q4.3 79.53,8.87 80.71,7.69 U$2.1
  Bottom 0.152: v77.14,10.38 77.94,10.38 78.59,11.04 X3.2
N$24
  Top 0.152: U7.8 91.6,66.1 92.45,65.25 R40.1 92.45,64 92.66,63.8 94.25,63.8 R39.2
N$25
  Top 0.152: R20.2 70.54,6.6 Q5.1
N$26  (via drill 0.35)
  Top 0.152: v71.53,8.87 Q5.3 72.55,8.85 73.4,8 73.4,7.46 U$3.1
  Bottom 0.152: X4.2 72.78,11.68 71.53,10.43 v71.53,8.87
PUMP_SIGNAL  (via drill 0.2)
  Top 0.152: R18.1 76.99,3.81 | R19.2 77.5,3.3 76.99,3.81 | U5.24 76.39,65 v76.8,64.6 | v82.3,15.8 80.91,14.4 70.7,14.4 69.6,13.3 69.6,2.8 71.23,1.17 74.9,1.17 76.99,3.26 76.99,3.81
  Bottom 0.152: v76.8,64.6 76.87,64.53 76.87,60.5 80.79,56.58 80.79,53.95 86.09,48.65 86.09,38.34 84.66,36.91 84.66,18.16 v82.3,15.8
RESET  (via drill 0.2)
  Top 0.152: v72.6,71.1 72.6,71.4 Q7.3 | v60.4,53.1 59.87,52.57 U5.3
  Bottom 0.152: v72.6,71.1 69.2,67.7 69.2,55.3 67.3,53.4 60.7,53.4 v60.4,53.1
RTS
  Top 0.152: U7.24 83.1,68.1 82.4,68.8 82.4,71.6 81.2,72.8 78.4,72.8 78.11,73.08 R17.1 76.7,74.6 75.6,75.7 73.1,75.7 72.75,75.35 Q7.2
RXD0  (via drill 0.45)
  Top 0.152: v63.35,72.25 62.41,71.31 U5.34 | v81.4,69.6 81.4,69.4 80.8,68.8 80.8,67.5 81.2,67.1 U7.26
  Bottom 0.152: v81.4,69.6 78.3,72.7 63.8,72.7 v63.35,72.25
SPI_CLK  (via drill 0.2)
  Top 0.152: J1.10 6.35,32.25 9.91,35.81 9.91,54.95 11.8,56.85 11.8,62.9 20.1,71.2 21.4,71.2 22.59,72.39 22.6,72.39 v25.8,72.39 | U5.23 81.14,63.73 82.9,65.5 v82.95,65.45 | v30.25,75.78 31.07,76.6 v66.2,76.6
  Bottom 0.152: v82.95,65.45 82.95,75.45 81.8,76.6 v66.2,76.6 | v30.25,75.78 30.25,74.55 28.09,72.39 v25.8,72.39
SPI_CS  (via drill 0.2)
  Top 0.152: U5.30 67.49,72.31 66.5,73.31 19.41,73.31 v18.7,72.6 | J1.9 7.18,31.75 v10.03,34.6
  Bottom 0.152: v10.03,34.6 10.03,62.73 17.6,70.3 17.6,71.5 v18.7,72.6
SPI_MISO  (via drill 0.2)
  Top 0.152: J1.14 6.28,34.25 9.3,37.27 9.3,61.01 v20.25,71.95 | U5.27 71.3,73.6 71.1,73.8 v71,73.8 | v67.8,75 28.2,75 28,75.2 v26.5,75.2
  Bottom 0.152: v26.5,75.2 26.29,75.2 23.05,71.95 v20.25,71.95 | v67.8,75 68.9,73.9 70.9,73.9 v71,73.8
SPI_MOSI  (via drill 0.2)
  Top 0.152: U5.28 70.03,73.07 v69.8,73.3 v69.8,73.31 | v64.5,73.91 64.2,73.61 27.49,73.61 v27.09,74.01 | v11,58.6 11,56.48 9.61,55.08 9.61,36.94 6.41,33.75 J1.13
  Bottom 0.152: v64.5,73.9 v64.5,73.91 67.49,73.91 68.09,73.31 v69.8,73.31 | v27.09,74.01 26.49,74.01 11.08,58.6 v11,58.6
SW  (via drill 0.35)
  Top 0.152: U$4.2 94.41,12.01 v96.9,14.5 | v98.03,37 97.08,36.05 U2.4
  Top 0.305: U2.3 U2.4
  Bottom 0.152: v96.9,14.5 96.9,31.7 98.33,33.13 98.33,36.7 v98.03,37
TXD0  (via drill 0.45)
  Top 0.152: v61.6,71.1 61.14,70.64 U5.35 | v81.63,68.03 82.06,67.6 U7.25
  Bottom 0.152: v81.63,68.03 77.66,72 64.6,72 64.1,71.5 62,71.5 v61.6,71.1
USB_D+  (via drill 0.2)
  Top 0.152: v86.8,63.07 86.8,63.1 86.2,63.7 U7.4 | v94.1,44.7 94.4,44.7 95.2,45.5 J2.3
  Bottom 0.152: v86.8,63.07 90.6,59.27 90.6,54.23 94.13,50.7 94.13,44.73 v94.1,44.7
USB_D-  (via drill 0.2)
  Top 0.152: v87,63.9 86.7,64.2 U7.5 | v95,46.28 95.85,46.28 95.98,46.15 J2.2
  Bottom 0.152: v87,63.9 88.6,62.3 88.6,61.7 90.91,59.39 90.91,54.36 94.5,50.76 94.5,46.8 95.02,46.28 v95,46.28
VALVE_SIGNAL  (via drill 0.2)
  Top 0.152: R20.1 70.54,3.66 71.07,3.13 R21.2 71.98,3.1 v75,3.1 | U5.26 72.57,66.53 72.9,66.2 v76.1,66.2 | v68.3,15.3 v68.3,10.4
  Bottom 0.152: v76.1,66.2 76.27,66.03 76.27,64.38 76.56,64.08 76.56,60.37 80.49,56.45 80.49,53.82 85.79,48.52 85.79,38.46 84.26,36.94 84.26,18.76 80.8,15.3 v68.3,15.3 | v68.3,10.4 68.3,4.9 70.1,3.1 v75,3.1
VBAT  (via drill 0.2, 0.35)
  Top 0.152: 91.77,48.93 v91.8,48.9 | R10.2 93.57,39.33 v94,38.9 | R9.2 92.23,36.18 94.16,38.1 | Q1.2 89.86,31.26 88.39,29.79 C4.1 88.39,25.58 C3.2 88.37,22.18 U$4.1 | v92.26,54.55 92.55,54.26 U4.3 | v85.15,63.89 R35.2
  Top 0.305: 91.07,48.93 U1.1 90.53,50.91 U4.3 | U1.20 91.42,48.58 91.07,48.93 | 91.07,48.93 91.77,48.93 | v94,38.9 94.16,38.74 94.16,38.1 U2.8
  Bottom 0.152: Q1.2 91.11,33.52 R9.2 | v92.26,54.55 92.19,54.55 91.21,55.53 91.21,60.91 87.64,64.48 86.26,64.48 85.67,63.89 v85.15,63.89
  Bottom 0.305: v91.8,48.9 92.9,47.8 92.9,40 v94,38.9
  other vias: 89.86,32.27 91.11,36.18
VLIPO  (via drill 0.2, 0.35)
  Top 0.152: 91.46,46.1 U1.16 93.06,46.06 v93.6,46.6 | R4.2 89.46,54.94 v89.5,54.9 | 91.4,43.75 C2.2 91.42,43.73 | 91.06,45.17
  Top 0.305: X2.1 86,38.3 88.4,40.7 92.9,40.7 93.4,41.2 93.4,43.2 93.06,43.54 C2.2 | U1.14 U1.15 91.06,45.17 91.42,45.53 | U1.16 91.42,45.53 | 91.42,43.73 91.42,45.53
  Bottom 0.152: v89.5,54.9 93.6,50.8 v93.6,46.6
VLIPO_SENSE  (via drill 0.2)
  Top 0.152: R35.1 83.27,62.64 R36.2 81.77,62.6 v81.6,62.77 | v70.71,63.5 62.04,63.5 59.87,65.67 U5.36
  Bottom 0.152: v81.6,62.77 76.99,67.38 74.59,67.38 v70.71,63.5
VPCC
  Top 0.152: R4.1 86.9,54.78 86.9,53.33 87.28,52.95 | U1.2 90.05,50.18 87.28,52.95 | R3.2 87.28,52.95
VREG_INPUT
  Top 0.152: U3.1 92.68,56.05 U4.2 | U4.2 U$1.2 91.78,60.87 R2.1 | U4.2